# EAGLE schematic SK3000v1 - 3 FINAL (EAGLE 7.1.0)
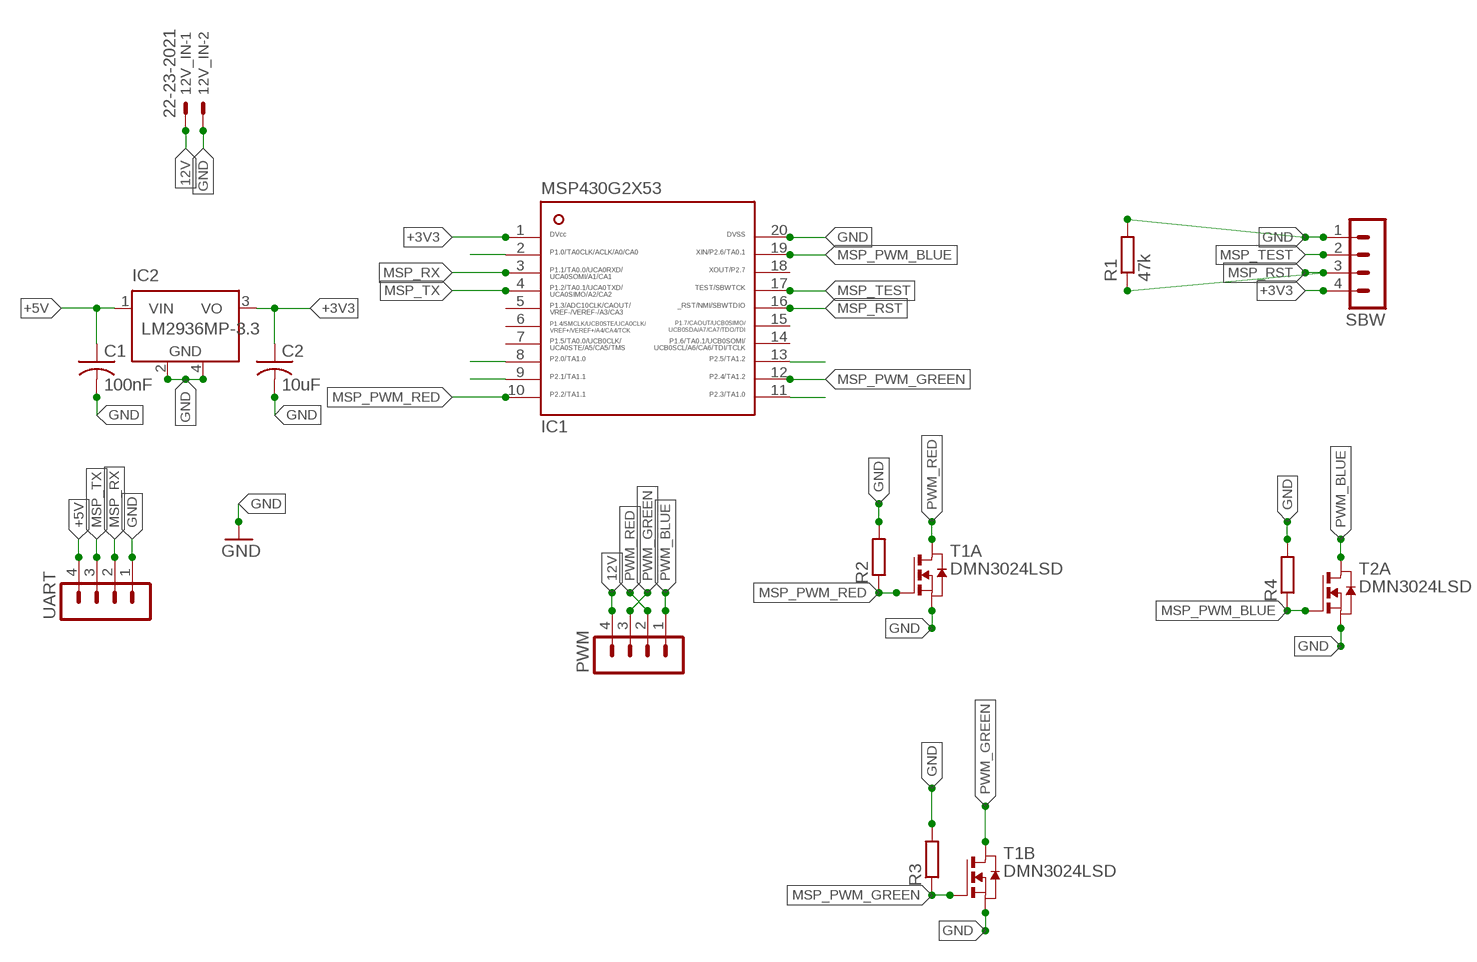
[diagram p0: schematic, sheet 1]

## Parts
12V_IN  22-23-2021  [22-23-2021]
C1  100nF  C-US025-024X044  [C025-024X044]
C2  10uF  C-US025-024X044  [C025-024X044]
IC1  MSP430G2553  MSP430G2X53-20PW20  [PW20]
IC2  LM2936MP-3.3  [SOT223]
PWM  MA04-1  [MA04-1]
R1  47k  R-EU_R0603  [R0603]
R2  R-EU_R0603  [R0603]
R3  R-EU_R0603  [R0603]
R4  R-EU_R0603  [R0603]
SBW  MA04-1  [MA04-1]
T1  DMN3024LSD  [SO8]
T2  DMN3024LSD  [SO8]
UART  MA04-1  [MA04-1]

## Nets
12V: 12V_IN.1 PWM.4
+3V3: C2.1 IC1.1 IC2.3(VO) SBW.4
+5V: C1.1 IC2.1(VIN) UART.4
GND: 12V_IN.2 C1.2 C2.2 IC1.20 IC2.2(GND) IC2.4(GND) R1.2 R2.2 R3.2 R4.2 SBW.1 T1.1(A:S) T1.3(B:S) T2.1(A:S) UART.1
MSP_PWM_BLUE: IC1.19 R4.1 T2.2(A:G)
MSP_PWM_GREEN: IC1.12 R3.1 T1.4(B:G)
MSP_PWM_RED: IC1.10 R2.1 T1.2(A:G)
MSP_RST: IC1.16 R1.1 SBW.3
MSP_RX: IC1.3 UART.2
MSP_TEST: IC1.17 SBW.2
MSP_TX: IC1.4 UART.3
N$32: IC1.2
N$33: IC1.8
N$34: IC1.9
N$36: IC1.13
N$37: IC1.11
PWM_BLUE: PWM.1 T2.7(A:D) T2.8(A:D)
PWM_GREEN: PWM.3 T1.5(B:D) T1.6(B:D)
PWM_RED: PWM.2 T1.7(A:D) T1.8(A:D)
Unconnected: IC1.5 IC1.6 IC1.7 IC1.14 IC1.15 IC1.18 T2.3(B:S) T2.4(B:G) T2.5(B:D) T2.6(B:D)

## Library data of the parts
12V_IN = con-molex:22-23-2021: .100" (2.54mm) Center Header - 2 Pin; MF: MOLEX; MPN: 22-23-2021; OC_FARNELL: 1462926; OC_NEWARK: 25C3832
C1 C2 = adafruit:C-US: CAPACITOR, American symbol
IC1 = ti_msp430:MSP430G2X53-20
IC2 = national-semiconductor:LM2936MP?*: Ultra-Low Quiescent Current LDO Voltage Regulator Source: Data sheet <http://www.national.com/ds/LM/LM2936.pdf>; MF: NATIONAL SEMICONDUCTOR; MPN: LM2936MP-3.3/NOPB; OC_FARNELL: 1469062; OC_NEWARK: 41K4523
PWM SBW UART = con-lstb:MA04-1: PIN HEADER; OC_FARNELL: unknown; OC_NEWARK: unknown
R1-R4 = rcl:R-EU_: RESISTOR, European symbol
T1 T2 = zetex:DMN3024LSD: 30V DUAL N-CHANNEL ENHANCEMENT MODE MOSFET Source: Data sheet <http://www.diodes.com/datasheets/DMN3024LSD.pdf>; OC_FARNELL: unknown; OC_NEWARK: unknown